# Altium schematic sheet Falcon.SchDoc
size A3; SheetNumber: 1; SheetTotal: 2
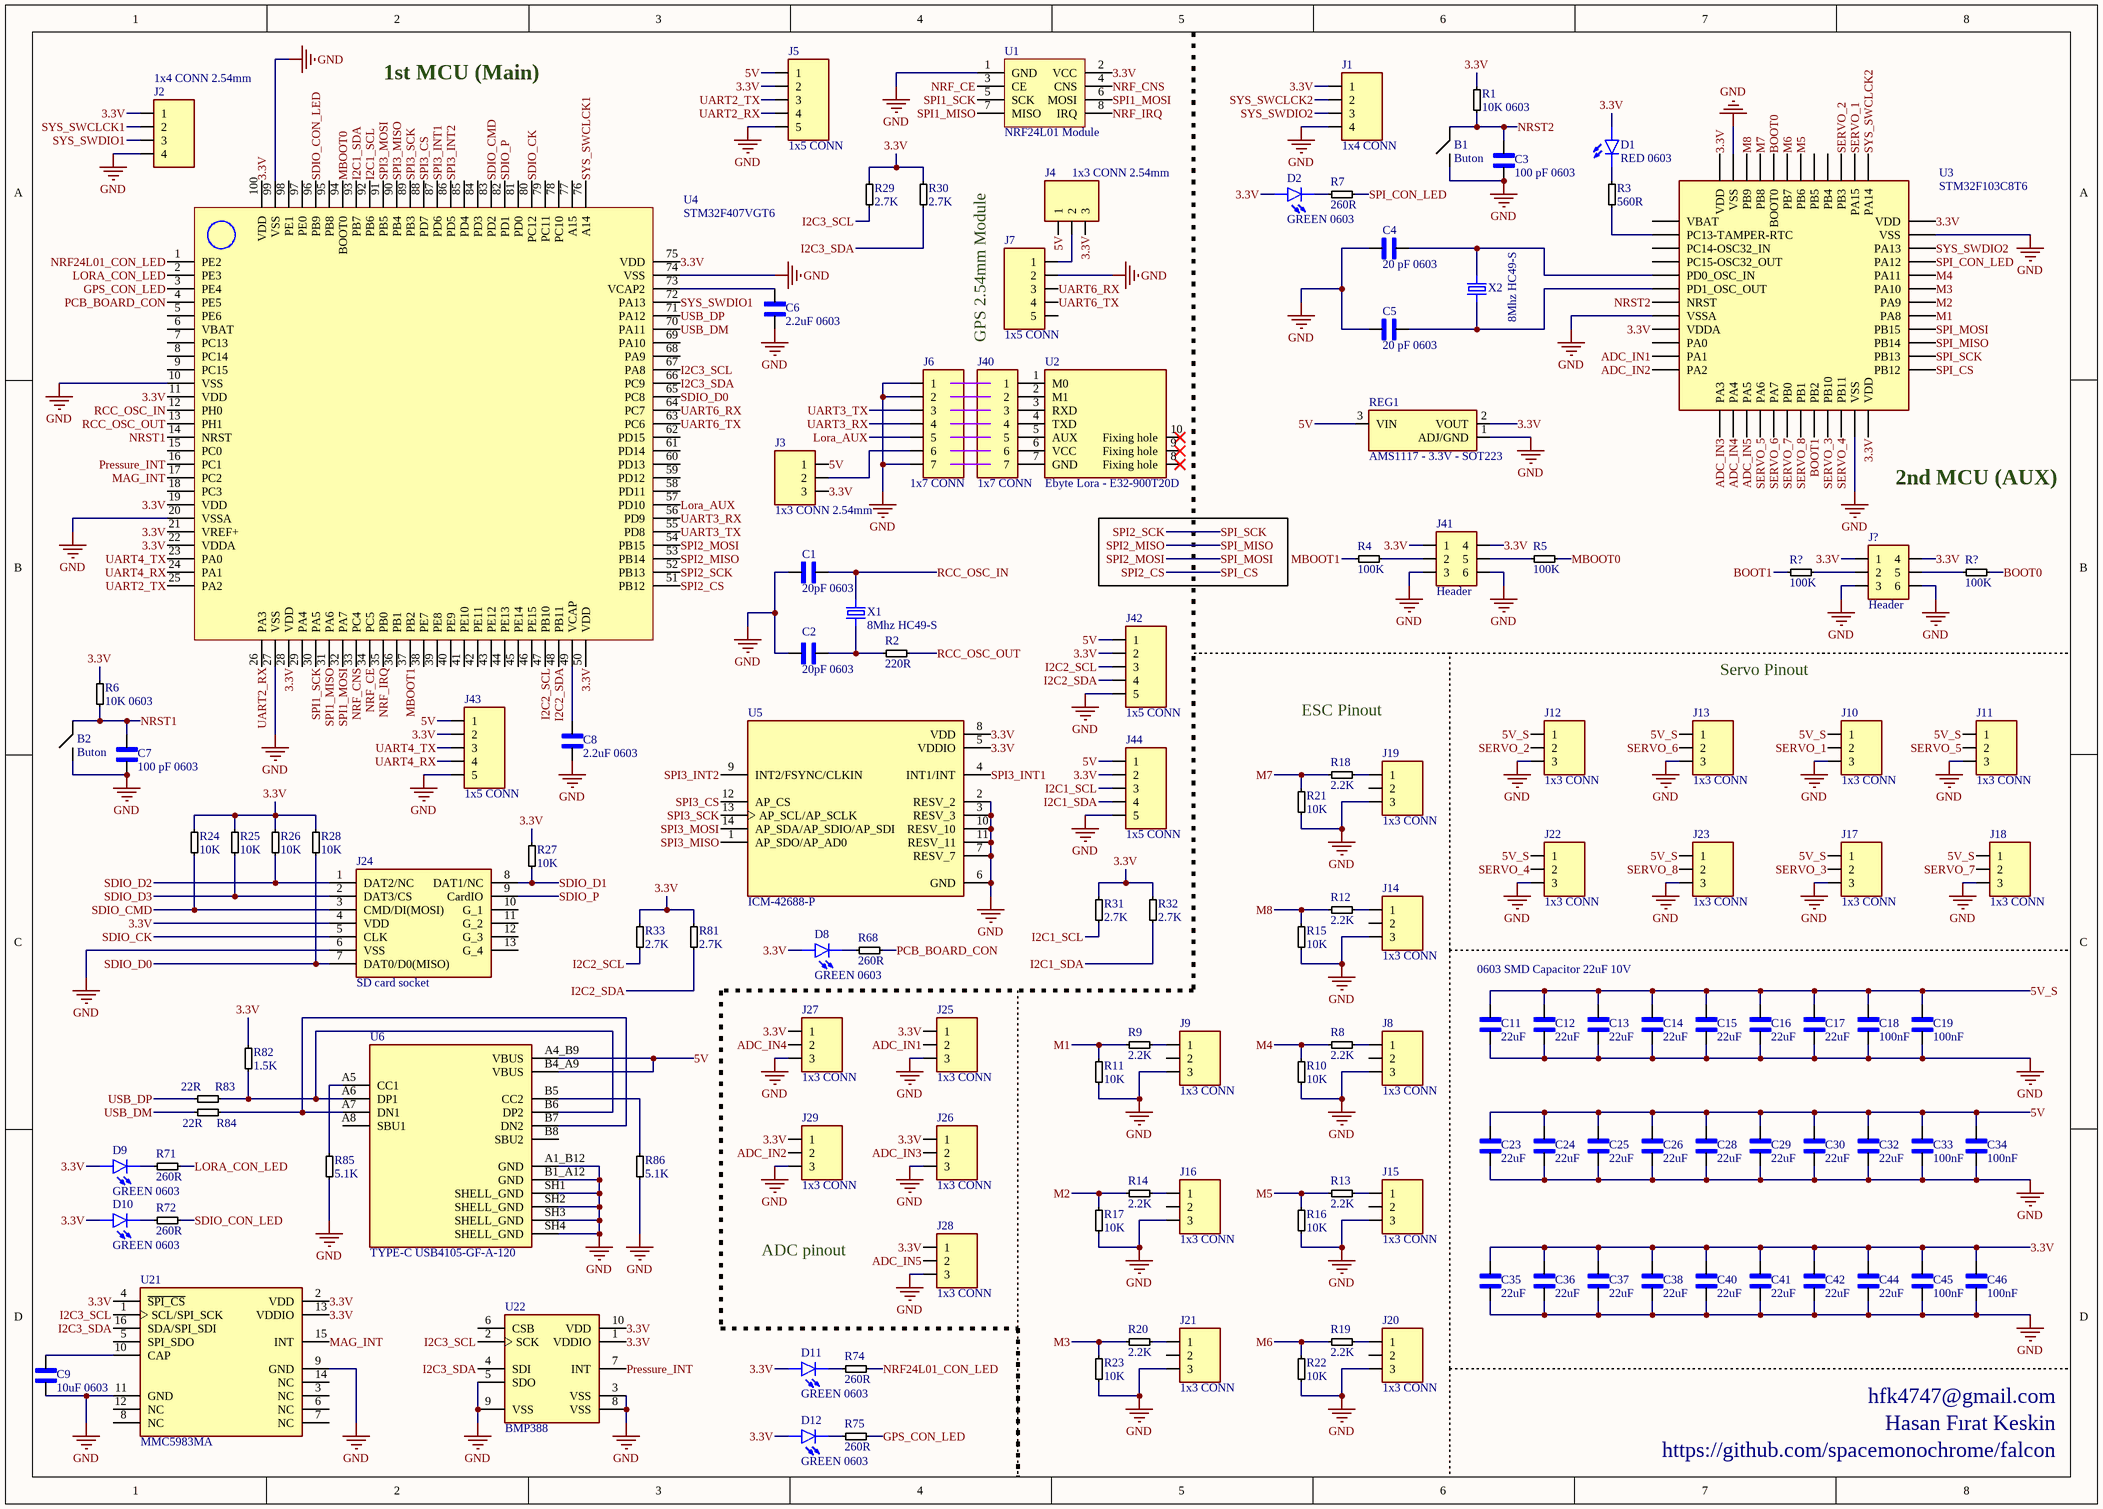
[diagram p0: Falcon.SchDoc]

## Parts
(Parts that share a designator on the sheet are numbered #1, #2 ... from top to bottom, then left to right.)
B1  Buton  [SMD TACT SWITCH BUTTON]
B2  Buton  [SMD TACT SWITCH BUTTON]
C1  20pF 0603  [0603 SMD CAP]
C2  20pF 0603  [0603 SMD CAP]
C3  100 pF 0603  [0603 SMD CAP]
C4  20 pF 0603  [0603 SMD CAP]
C5  20 pF 0603  [0603 SMD CAP]
C6  2.2uF 0603  [0603 SMD CAP]
C7  100 pF 0603  [0603 SMD CAP]
C8  2.2uF 0603  [0603 SMD CAP]
C9  10uF 0603  [0603 SMD CAP]
C11  22uF  [0603 SMD CAP]
C12  22uF  [0603 SMD CAP]
C13  22uF  [0603 SMD CAP]
C14  22uF  [0603 SMD CAP]
C15  22uF  [0603 SMD CAP]
C16  22uF  [0603 SMD CAP]
C17  22uF  [0603 SMD CAP]
C18  100nF  [0603 SMD CAP]
C19  100nF  [0603 SMD CAP]
C23  22uF  [0603 SMD CAP]
C24  22uF  [0603 SMD CAP]
C25  22uF  [0603 SMD CAP]
C26  22uF  [0603 SMD CAP]
C28  22uF  [0603 SMD CAP]
C29  22uF  [0603 SMD CAP]
C30  22uF  [0603 SMD CAP]
C32  22uF  [0603 SMD CAP]
C33  100nF  [0603 SMD CAP]
C34  100nF  [0603 SMD CAP]
C35  22uF  [0603 SMD CAP]
C36  22uF  [0603 SMD CAP]
C37  22uF  [0603 SMD CAP]
C38  22uF  [0603 SMD CAP]
C40  22uF  [0603 SMD CAP]
C41  22uF  [0603 SMD CAP]
C42  22uF  [0603 SMD CAP]
C44  22uF  [0603 SMD CAP]
C45  100nF  [0603 SMD CAP]
C46  100nF  [0603 SMD CAP]
D1  RED 0603  [0603 SMD LED]
D2  GREEN 0603  [0603 SMD LED]
D8  GREEN 0603  [0603 SMD LED]
D9  GREEN 0603  [0603 SMD LED]
D10  GREEN 0603  [0603 SMD LED]
D11  GREEN 0603  [0603 SMD LED]
D12  GREEN 0603  [0603 SMD LED]
J1  1x4 CONN  [CON1x4_2.54MM]
J2  1x4 CONN 2.54mm  [CON1x4_2.54MM]
J3  1x3 CONN 2.54mm  [CON1x3_2.54MM]
J4  1x3 CONN 2.54mm  [CON1x3_2.54MM]
J5  1x5 CONN  [CON1x5_2.54MM]
J6  1x7 CONN  [CON1x7_2.54MM]
J7  1x5 CONN  [CON1x5_2.54MM]
J8  1x3 CONN  [CON1x3_2.54MM]
J9  1x3 CONN  [CON1x3_2.54MM]
J10  1x3 CONN  [CON1x3_2.54MM]
J11  1x3 CONN  [CON1x3_2.54MM]
J12  1x3 CONN  [CON1x3_2.54MM]
J13  1x3 CONN  [CON1x3_2.54MM]
J14  1x3 CONN  [CON1x3_2.54MM]
J15  1x3 CONN  [CON1x3_2.54MM]
J16  1x3 CONN  [CON1x3_2.54MM]
J17  1x3 CONN  [CON1x3_2.54MM]
J18  1x3 CONN  [CON1x3_2.54MM]
J19  1x3 CONN  [CON1x3_2.54MM]
J20  1x3 CONN  [CON1x3_2.54MM]
J21  1x3 CONN  [CON1x3_2.54MM]
J22  1x3 CONN  [CON1x3_2.54MM]
J23  1x3 CONN  [CON1x3_2.54MM]
J24  SD card socket  [L-KLS1-TF-003-H1.85-R]
J25  1x3 CONN  [CON1x3_2.54MM]
J26  1x3 CONN  [CON1x3_2.54MM]
J27  1x3 CONN  [CON1x3_2.54MM]
J28  1x3 CONN  [CON1x3_2.54MM]
J29  1x3 CONN  [CON1x3_2.54MM]
J40  1x7 CONN  [CON1x7_2.54MM]
J41  Header  [CON2x3_2.54MM]
J42  1x5 CONN  [CON1x5_2.54MM]
J43  1x5 CONN  [CON1x5_2.54MM]
J44  1x5 CONN  [CON1x5_2.54MM]
J?  Header  [CON2x3_2.54MM]
R1  10K 0603  [0603 SMD RES]
R2  220R  [0603 SMD RES]
R3  560R  [0603 SMD RES]
R4  100K  [0603 SMD RES]
R5  100K  [0603 SMD RES]
R6  10K 0603  [0603 SMD RES]
R7  260R  [0603 SMD RES]
R8  2.2K  [0603 SMD RES]
R9  2.2K  [0603 SMD RES]
R10  10K  [0603 SMD RES]
R11  10K  [0603 SMD RES]
R12  2.2K  [0603 SMD RES]
R13  2.2K  [0603 SMD RES]
R14  2.2K  [0603 SMD RES]
R15  10K  [0603 SMD RES]
R16  10K  [0603 SMD RES]
R17  10K  [0603 SMD RES]
R18  2.2K  [0603 SMD RES]
R19  2.2K  [0603 SMD RES]
R20  2.2K  [0603 SMD RES]
R21  10K  [0603 SMD RES]
R22  10K  [0603 SMD RES]
R23  10K  [0603 SMD RES]
R24  10K  [0603 SMD RES]
R25  10K  [0603 SMD RES]
R26  10K  [0603 SMD RES]
R27  10K  [0603 SMD RES]
R28  10K  [0603 SMD RES]
R29  2.7K  [0603 SMD RES]
R30  2.7K  [0603 SMD RES]
R31  2.7K  [0603 SMD RES]
R32  2.7K  [0603 SMD RES]
R33  2.7K  [0603 SMD RES]
R68  260R  [0603 SMD RES]
R71  260R  [0603 SMD RES]
R72  260R  [0603 SMD RES]
R74  260R  [0603 SMD RES]
R75  260R  [0603 SMD RES]
R81  2.7K  [0603 SMD RES]
R82  1.5K  [0603 SMD RES]
R83  22R  [0603 SMD RES]
R84  22R  [0603 SMD RES]
R85  5.1K  [0603 SMD RES]
R86  5.1K  [0603 SMD RES]
R?#1  100K  [0603 SMD RES]
R?#2  100K  [0603 SMD RES]
REG1  AMS1117 - 3.3V - SOT223  [SOT-223]
U1  NRF24L01 Module  [NRF24L01 MODULE]
U2  Ebyte Lora - E32-900T20D  [Ebyte LoRa Modul]
U3  STM32F103C8T6  [LQFP-48]
U4  STM32F407VGT6  [LQFP-100]
U5  ICM-42688-P  [LGA-14]
U6  TYPE-C USB4105-GF-A-120  [TYPE-C USB4105-GF-A-120]
U21  MMC5983MA  [VFLGA-16]
U22  BMP388  [WFLGA-10]
X1  8Mhz HC49-S  [HC49-S Crystal Oscillator]
X2  8Mhz HC49-S  [HC49-S Crystal Oscillator]

## Nets
GND: B1.0 B2.0 C1.2 C2.2 C3.2 C4.2 C5.2 C6.2 C7.2 C8.2 C9.2 C11.2 C12.2 C13.2 C14.2 C15.2 C16.2 C17.2 C18.2 C19.2 C23.2 C24.2 C25.2 C26.2 C28.2 C29.2 C30.2 C32.2 C33.2 C34.2 C35.2 C36.2 C37.2 C38.2 C40.2 C41.2 C42.2 C44.2 C45.2 C46.2 J1.4 J2.4 J5.5 J6.1 J6.2 J6.7 J7.2 J8.3 J9.3 J10.3 J11.3 J12.3 J13.3 J14.3 J15.3 J16.3 J17.3 J18.3 J19.3 J20.3 J21.3 J22.3 J23.3 J24.6(VSS) J25.3 J26.3 J27.3 J28.3 J29.3 J41.3 J41.6 J42.5 J43.5 J44.5 J?.3 J?.6 R10.1 R11.1 R15.1 R16.1 R17.1 R21.1 R22.1 R23.1 R85.1 R86.1 REG1.1(ADJ/GND) U1.1(GND) U3.8(VSSA) U3.23(VSS) U3.35(VSS) U3.47(VSS) U4.10(VSS) U4.20(VSSA) U4.27(VSS) U4.74(VSS) U4.99(VSS) U5.2(RESV_2) U5.3(RESV_3) U5.6(GND) U5.7(RESV_7) U5.10(RESV_10) U5.11(RESV_11) U6.A1_B12(GND) U6.B1_A12(GND) U6.SH1(SHELL_GND) U6.SH2(SHELL_GND) U6.SH3(SHELL_GND) U6.SH4(SHELL_GND) U21.9(GND) U21.11(GND) U22.3(VSS) U22.5(SDO) U22.8(VSS) U22.9(VSS)
3.3V: C35.1 C36.1 C37.1 C38.1 C40.1 C41.1 C42.1 C44.1 C45.1 C46.1 D1.A D2.A D8.A D9.A D10.A D11.A D12.A J1.1 J2.1 J3.3 J4.3 J5.2 J24.4(VDD) J25.1 J26.1 J27.1 J28.1 J29.1 J41.1 J41.4 J42.2 J43.2 J44.2 J?.1 J?.4 R1.1 R6.1 R24.2 R25.2 R26.2 R27.1 R28.2 R29.2 R30.2 R31.2 R32.2 R33.2 R81.2 R82.2 REG1.2(VOUT) U1.2(VCC) U3.9(VDDA) U3.24(VDD) U3.36(VDD) U3.48(VDD) U4.11(VDD) U4.19(VDD) U4.21(VREF+) U4.22(VDDA) U4.28(VDD) U4.50(VDD) U4.75(VDD) U4.100(VDD) U5.5(VDDIO) U5.8(VDD) U21.2(VDD) U21.4(~{SPI_CS}) U21.13(VDDIO) U22.1(VDDIO) U22.10(VDD)
5V: C23.1 C24.1 C25.1 C26.1 C28.1 C29.1 C30.1 C32.1 C33.1 C34.1 J3.1 J4.1 J5.1 J42.1 J43.1 J44.1 REG1.3(VIN) U6.A4_B9(VBUS) U6.B4_A9(VBUS)
5V_S: C11.1 C12.1 C13.1 C14.1 C15.1 C16.1 C17.1 C18.1 C19.1 J10.1 J11.1 J12.1 J13.1 J17.1 J18.1 J22.1 J23.1
ADC_IN1: J25.2 U3.11(PA1)
ADC_IN2: J29.2 U3.12(PA2)
ADC_IN3: J26.2 U3.13(PA3)
ADC_IN4: J27.2 U3.14(PA4)
ADC_IN5: J28.2 U3.15(PA5)
BOOT0: R?#2.2 U3.44(BOOT0)
BOOT1: R?#1.1 U3.20(PB2)
GPS_CON_LED: R75.2 U4.3(PE4)
I2C1_SCL: J44.3 R31.1 U4.92(PB6)
I2C1_SDA: J44.4 R32.1 U4.93(PB7)
I2C2_SCL: J42.3 R33.1 U4.47(PB10)
I2C2_SDA: J42.4 R81.1 U4.48(PB11)
I2C3_SCL: R29.1 U4.67(PA8) U21.1(SCL/SPI_SCK) U22.2(SCK)
I2C3_SDA: R30.1 U4.66(PC9) U21.16(SDA/SPI_SDI) U22.4(SDI)
Lora_AUX: J6.5 U4.57(PD10)
LORA_CON_LED: R71.2 U4.2(PE3)
M1: R9.1 R11.2 U3.29(PA8)
M2: R14.1 R17.2 U3.30(PA9)
M3: R20.1 R23.2 U3.31(PA10)
M4: R8.1 R10.2 U3.32(PA11)
M5: R13.1 R16.2 U3.42(PB6)
M6: R19.1 R22.2 U3.43(PB7)
M7: R18.1 R21.2 U3.45(PB8)
M8: R12.1 R15.2 U3.46(PB9)
MAG_INT: U4.17(PC2) U21.15(INT)
MBOOT0: R5.2 U4.94(BOOT0)
MBOOT1: R4.1 U4.37(PB2)
NRF24L01_CON_LED: R74.2 U4.1(PE2)
NRF_CE: U1.3(CE) U4.34(PC5)
NRF_CNS: U1.4(CNS) U4.33(PC4)
NRF_IRQ: U1.8(IRQ) U4.35(PB0)
NRST1: B2.1 C7.1 R6.2 U4.14(NRST)
NRST2: B1.1 C3.1 R1.2 U3.7(NRST)
PCB_BOARD_CON: R68.2 U4.4(PE5)
Pressure_INT: U4.16(PC1) U22.7(INT)
RCC_OSC_IN: C1.1 U4.12(PH0) X1.2
RCC_OSC_OUT: R2.2 U4.13(PH1)
SDIO_CK: J24.5(CLK) U4.80(PC12)
SDIO_CMD: J24.3(CMD/DI(MOSI)) R24.1 U4.83(PD2)
SDIO_CON_LED: R72.2 U4.96(PB9)
SDIO_D0: J24.7(DAT0/D0(MISO)) R28.1 U4.65(PC8)
SDIO_D1: J24.8(DAT1/NC) R27.2
SDIO_D2: J24.1(DAT2/NC) R26.1
SDIO_D3: J24.2(DAT3/CS) R25.1
SDIO_P: J24.9(CardIO) U4.82(PD1)
SERVO_1: J10.2 U3.38(PA15)
SERVO_2: J12.2 U3.39(PB3)
SERVO_3: J17.2 U3.21(PB10)
SERVO_4: J22.2 U3.22(PB11)
SERVO_5: J11.2 U3.16(PA6)
SERVO_6: J13.2 U3.17(PA7)
SERVO_7: J18.2 U3.18(PB0)
SERVO_8: J23.2 U3.19(PB1)
SPI1_MISO: U1.7(MISO) U4.31(PA6)
SPI1_MOSI: U1.6(MOSI) U4.32(PA7)
SPI1_SCK: U1.5(SCK) U4.30(PA5)
SPI2_CS: U3.25(PB12) U4.51(PB12)  [also labelled SPI_CS]
SPI2_MISO: U3.27(PB14) U4.53(PB14)  [also labelled SPI_MISO]
SPI2_MOSI: U3.28(PB15) U4.54(PB15)  [also labelled SPI_MOSI]
SPI2_SCK: U3.26(PB13) U4.52(PB13)  [also labelled SPI_SCK]
SPI3_CS: U4.88(PD7) U5.12(AP_CS)
SPI3_INT1: U4.87(PD6) U5.4(INT1/INT)
SPI3_INT2: U4.86(PD5) U5.9(INT2/FSYNC/CLKIN)
SPI3_MISO: U4.90(PB4) U5.1(AP_SDO/AP_AD0)
SPI3_MOSI: U4.91(PB5) U5.14(AP_SDA/AP_SDIO/AP_SDI)
SPI3_SCK: U4.89(PB3) U5.13(AP_SCL/AP_SCLK)
SPI_CON_LED: R7.2 U3.33(PA12)
SYS_SWCLCK1: J2.2 U4.76(A14)
SYS_SWCLCK2: J1.2 U3.37(PA14)
SYS_SWDIO1: J2.3 U4.72(PA13)
SYS_SWDIO2: J1.3 U3.34(PA13)
UART2_RX: J5.4 U4.26(PA3)
UART2_TX: J5.3 U4.25(PA2)
UART3_RX: J6.4 U4.56(PD9)
UART3_TX: J6.3 U4.55(PD8)
UART4_RX: J43.4 U4.24(PA1)
UART4_TX: J43.3 U4.23(PA0)
UART6_RX: J7.3 U4.64(PC7)
UART6_TX: J7.4 U4.63(PC6)
USB_DM: R84.1 U4.70(PA11)
USB_DP: R83.1 U4.71(PA12)
NetC2_1: C2.1 R2.1 X1.1
NetC4_1: C4.1 U3.5(PD0_OSC_IN) X2.2
NetC5_1: C5.1 U3.6(PD1_OSC_OUT) X2.1
NetC6_1: C6.1 U4.73(VCAP2)
NetC8_1: C8.1 U4.49(VCAP)
NetC9_1: C9.1 U21.10(CAP)
NetD1_C: D1.C R3.1
NetD2_C: D2.C R7.1
NetD8_C: D8.C R68.1
NetD9_C: D9.C R71.1
NetD10_C: D10.C R72.1
NetD11_C: D11.C R74.1
NetD12_C: D12.C R75.1
NetJ3_2: J3.2 J6.6
NetJ4_2: J4.2 J7.1
NetJ8_1: J8.1 R8.2
NetJ9_1: J9.1 R9.2
NetJ14_1: J14.1 R12.2
NetJ15_1: J15.1 R13.2
NetJ16_1: J16.1 R14.2
NetJ19_1: J19.1 R18.2
NetJ20_1: J20.1 R19.2
NetJ21_1: J21.1 R20.2
NetJ40_1: J40.1 U2.1(M0)
NetJ40_2: J40.2 U2.2(M1)
NetJ40_3: J40.3 U2.3(RXD)
NetJ40_4: J40.4 U2.4(TXD)
NetJ40_5: J40.5 U2.5(AUX)
NetJ40_6: J40.6 U2.6(VCC)
NetJ40_7: J40.7 U2.7(GND)
NetJ41_2: J41.2 R4.2
NetJ41_5: J41.5 R5.1
NetJ?_2: J?.2 R?#1.2
NetJ?_5: J?.5 R?#2.1
NetR3_2: R3.2 U3.2(PC13-TAMPER-RTC)
NetR82_1: R82.1 R83.2 U6.A6(DP1) U6.B6(DP2)
NetR84_2: R84.2 U6.A7(DN1) U6.B7(DN2)
NetR85_2: R85.2 U6.A5(CC1)
NetR86_2: R86.2 U6.B5(CC2)

Not connected (* = marked no-connect by the designer): J7 5; J8 2; J9 2; J14 2; J15 2; J16 2; J19 2; J20 2; J21 2; J24 10(G_1) 11(G_2) 12(G_3) 13(G_4); U2 8(Fixing_hole)* 9(Fixing_hole)* 10(Fixing_hole)*; U3 1(VBAT) 3(PC14-OSC32_IN) 4(PC15-OSC32_OUT) 10(PA0) 40(PB4) 41(PB5); U4 5(PE6) 6(VBAT) 7(PC13) 8(PC14) 9(PC15) 15(PC0) 18(PC3) 29(PA4) 36(PB1) 38(PE7) 39(PE8) 40(PE9) 41(PE10) 42(PE11) 43(PE12) 44(PE13) 45(PE14) 46(PE15) 58(PD11) 59(PD12) 60(PD13) 61(PD14) 62(PD15) 68(PA9) 69(PA10) 77(A15) 78(PC10) 79(PC11) 81(PD0) 84(PD3) 85(PD4) 95(PB8) 97(PE0) 98(PE1); U6 A8(SBU1) B8(SBU2); U21 3(NC) 5(SPI_SDO) 6(NC) 7(NC) 8(NC) 12(NC) 14(NC); U22 6(CSB)

## Notes on the sheet
- 1st MCU (Main)
- GPS 2.54mm Module
- 2nd MCU (AUX)
- ESC Pinout
- Servo Pinout
- 0603 SMD Capacitor 22uF 10V
- ADC pinout
- hfk4747@gmail.com
- https://github.com/spacemonochrome/falcon
- Hasan Fırat Keskin

## Library data of the parts
B1 B2 = SMD TACT SWITCH BUTTON
C1-C9 C11-C19 C23-C26 C28-C30 C32-C38 C40-C42 C44-C46 = CAP SMD 603
D1 D2 D8-D12 = LED 603 SMD
J1 J2 = CON1x4_2.54mm
J3 J4 J8-J23 J25-J29 = CON1x3_2.54mm
J5 J7 J42-J44 = CON1x5_2.54mm
J6 J40 = CON1x7_2.54mm
J24 = L-KLS1-TF-003-H1.85-R
J41 J? = CON2x3_2.54mm
R1-R33 R68 R71 R72 R74 R75 R81-R86 R?#1 R?#2 = RES SMD 0603
REG1 = AMS1117
U2 = Ebyte Lora
U5 = ICM42688-P
X1 X2 = HC49-S Crystal Oscillator